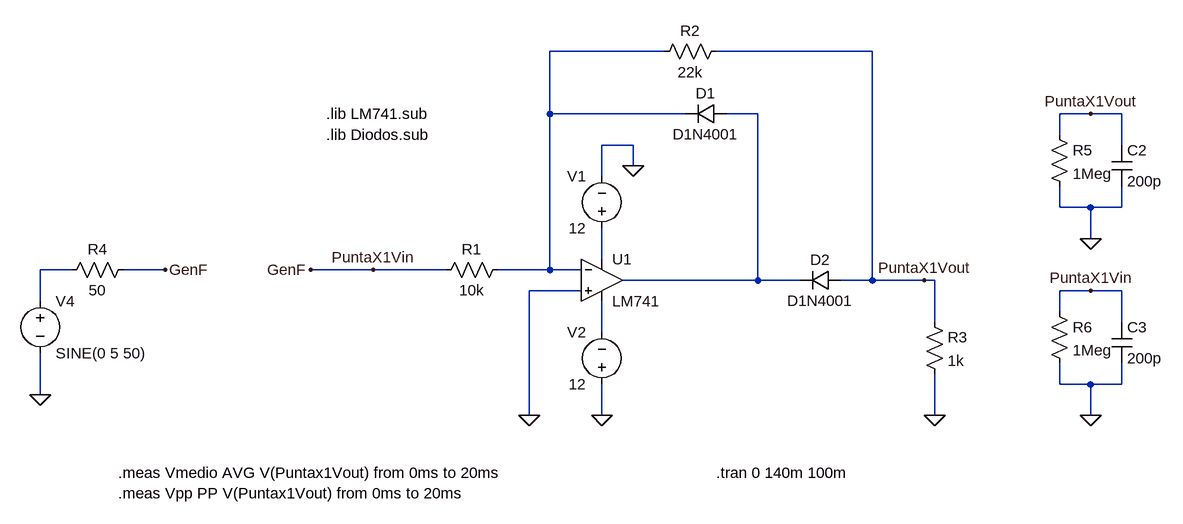
[diagram p0: schematic F4_22k.asc]
F4_22k.asc, the LTspice schematic file:
Version 4
SHEET 1 1304 900
WIRE 496 -64 320 -64
WIRE 816 -64 576 -64
WIRE 320 32 320 -64
WIRE 528 32 320 32
WIRE 640 32 592 32
WIRE 1152 32 1104 32
WIRE 1200 32 1152 32
WIRE 1104 64 1104 32
WIRE 448 80 400 80
WIRE 1200 80 1200 32
WIRE 448 112 448 80
WIRE 400 128 400 80
WIRE 1104 176 1104 144
WIRE 1152 176 1104 176
WIRE 1200 176 1200 144
WIRE 1200 176 1152 176
WIRE 1152 224 1152 176
WIRE 400 256 400 208
WIRE -416 272 -464 272
WIRE -272 272 -336 272
WIRE 48 272 -48 272
WIRE 160 272 48 272
WIRE 320 272 320 32
WIRE 320 272 240 272
WIRE 368 272 320 272
WIRE 640 288 640 32
WIRE 640 288 432 288
WIRE 704 288 640 288
WIRE 816 288 816 -64
WIRE 816 288 768 288
WIRE 896 288 816 288
WIRE 912 288 896 288
WIRE 368 304 288 304
WIRE 1152 304 1104 304
WIRE 1200 304 1152 304
WIRE -464 320 -464 272
WIRE 1104 336 1104 304
WIRE 912 352 912 288
WIRE 1200 352 1200 304
WIRE 400 368 400 320
WIRE 1104 448 1104 416
WIRE 1152 448 1104 448
WIRE 1200 448 1200 416
WIRE 1200 448 1152 448
WIRE -464 464 -464 400
WIRE 288 496 288 304
WIRE 400 496 400 448
WIRE 912 496 912 432
WIRE 1152 496 1152 448
FLAG 448 112 0
FLAG 400 496 0
FLAG 288 496 0
FLAG 912 496 0
FLAG 896 288 PuntaX1Vout
FLAG 1152 224 0
FLAG 1152 32 PuntaX1Vout
FLAG 1152 496 0
FLAG 1152 304 PuntaX1Vin
FLAG -464 464 0
FLAG -272 272 GenF
FLAG -48 272 GenF
FLAG 48 272 PuntaX1Vin
SYMBOL Opamps\\opamp2 400 224 R0
SYMATTR InstName U1
SYMATTR Value LM741
SYMBOL voltage 400 224 R180
WINDOW 0 24 96 Left 2
WINDOW 3 24 16 Left 2
WINDOW 123 0 0 Left 2
WINDOW 39 0 0 Left 2
SYMATTR InstName V1
SYMATTR Value 12
SYMBOL voltage 400 464 R180
WINDOW 0 24 96 Left 2
WINDOW 3 24 16 Left 2
WINDOW 123 0 0 Left 2
WINDOW 39 0 0 Left 2
SYMATTR InstName V2
SYMATTR Value 12
SYMBOL res 256 256 R90
WINDOW 0 0 56 VBottom 2
WINDOW 3 32 56 VTop 2
SYMATTR InstName R1
SYMATTR Value 10k
SYMBOL diode 592 16 R90
WINDOW 0 0 32 VBottom 2
WINDOW 3 32 32 VTop 2
SYMATTR InstName D1
SYMATTR Value D1N4001
SYMBOL diode 768 272 R90
WINDOW 0 0 32 VBottom 2
WINDOW 3 32 32 VTop 2
SYMATTR InstName D2
SYMATTR Value D1N4001
SYMBOL res 592 -80 R90
WINDOW 0 0 56 VBottom 2
WINDOW 3 32 56 VTop 2
SYMATTR InstName R2
SYMATTR Value 22k
SYMBOL res 896 336 R0
SYMATTR InstName R3
SYMATTR Value 1k
SYMBOL res 1088 48 R0
SYMATTR InstName R5
SYMATTR Value 1Meg
SYMBOL cap 1184 80 R0
SYMATTR InstName C2
SYMATTR Value 200p
SYMBOL res 1088 320 R0
SYMATTR InstName R6
SYMATTR Value 1Meg
SYMBOL cap 1184 352 R0
SYMATTR InstName C3
SYMATTR Value 200p
SYMBOL voltage -464 304 R0
WINDOW 123 0 0 Left 2
WINDOW 39 0 0 Left 2
SYMATTR InstName V4
SYMATTR Value SINE(0 5 50)
SYMBOL res -432 288 R270
WINDOW 0 32 56 VTop 2
WINDOW 3 0 56 VBottom 2
SYMATTR InstName R4
SYMATTR Value 50
TEXT -24 32 Left 2 !.lib LM741.sub
TEXT -24 64 Left 2 !.lib Diodos.sub
TEXT 576 584 Left 2 !.tran 0 140m 100m
TEXT -344 584 Left 2 !.meas Vmedio AVG V(Puntax1Vout) from 0ms to 20ms
TEXT -344 616 Left 2 !.meas Vpp PP V(Puntax1Vout) from 0ms to 20ms

The netlist it stands for:
* F4_22k.asc
XU1 0 N001 N003 N005 N002 LM741  ; pins In+ In- V+ V- OUT
V1 N003 0 12
V2 0 N005 12
R1 N001 GenF 10k
D1 N002 N001 D1N4001
D2 PuntaX1Vout N002 D1N4001
R2 PuntaX1Vout N001 22k
R3 PuntaX1Vout 0 1k
R5 PuntaX1Vout 0 1Meg
C2 PuntaX1Vout 0 200p
R6 GenF 0 1Meg
C3 GenF 0 200p
V4 N004 0 SINE(0 5 50)
R4 N004 GenF 50
.model D D
.lib standard.dio
.lib LM741.sub
.lib Diodos.sub
.tran 0 140m 100m
.meas Vmedio AVG V(Puntax1Vout) from 0ms to 20ms
.meas Vpp PP V(Puntax1Vout) from 0ms to 20ms
.backanno
.end